# EAGLE design Base components (EAGLE 6.5.0)
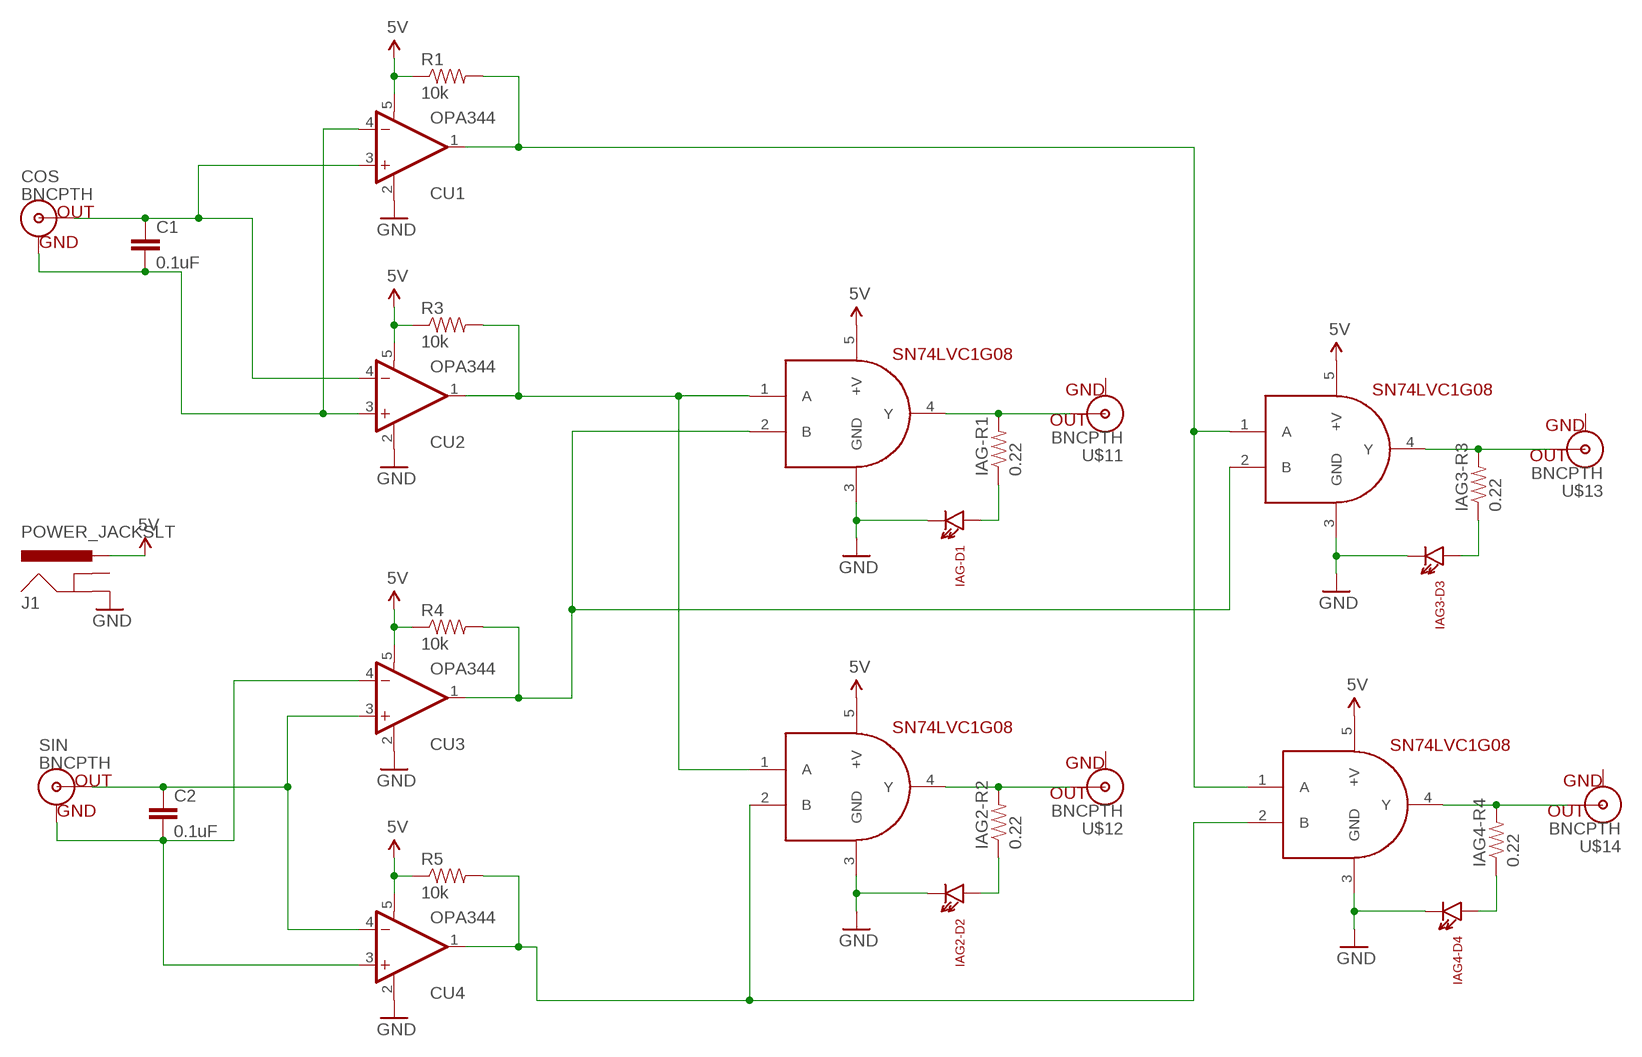
[diagram p0: schematic, sheet 1]

## Parts
C1  0.1uF  0.1UF-25V-5%(0603)  [0603-CAP]
C2  0.1uF  0.1UF-25V-5%(0603)  [0603-CAP]
COS  BNCPTH  [BNC]
CU1  OPA344  [SOT23-5]
CU2  OPA344  [SOT23-5]
CU3  OPA344  [SOT23-5]
CU4  OPA344  [SOT23-5]
IAG1  SN74LVC1G08  [SOT23-5]
IAG2  SN74LVC1G08  [SOT23-5]
IAG2-D2  LTE-302  [LTE-302]
IAG2-R2  0.22  0.22OHM1/4W1%(0805)  [0805]
IAG3  SN74LVC1G08  [SOT23-5]
IAG3-D3  LTE-302  [LTE-302]
IAG3-R3  0.22  0.22OHM1/4W1%(0805)  [0805]
IAG4  SN74LVC1G08  [SOT23-5]
IAG4-D4  LTE-302  [LTE-302]
IAG4-R4  0.22  0.22OHM1/4W1%(0805)  [0805]
IAG-D1  LTE-302  [LTE-302]
IAG-R1  0.22  0.22OHM1/4W1%(0805)  [0805]
J1  POWER_JACKSLT  [POWER_JACK_SLOT]
R1  10k  10KOHM-1/4W-1%(PTH)HORIZ  [AXIAL-0.3]
R3  10k  10KOHM-1/4W-1%(PTH)HORIZ  [AXIAL-0.3]
R4  10k  10KOHM-1/4W-1%(PTH)HORIZ  [AXIAL-0.3]
R5  10k  10KOHM-1/4W-1%(PTH)HORIZ  [AXIAL-0.3]
SIN  BNCPTH  [BNC]
U$11  BNCPTH  [BNC]
U$12  BNCPTH  [BNC]
U$13  BNCPTH  [BNC]
U$14  BNCPTH  [BNC]

## Nets
5V: CU1.5(V+) CU2.5(V+) CU3.5(V+) CU4.5(V+) IAG1.5(+V) IAG2.5(+V) IAG3.5(+V) IAG4.5(+V) J1.PWR R1.P$1 R3.P$1 R4.P$1 R5.P$1
GND: CU1.2(V-) CU2.2(V-) CU3.2(V-) CU4.2(V-) IAG1.3(GND) IAG2-D2.C IAG2.3(GND) IAG3-D3.C IAG3.3(GND) IAG4-D4.C IAG4.3(GND) IAG-D1.C J1.GND@2(GND)
N$1: CU1.1(OUT) IAG3.1(A) IAG4.1(A) R1.P$2
N$2: IAG4-R4.2 IAG4.4(Y) U$14.S(OUT)
N$3: IAG4-D4.A IAG4-R4.1
N$4: CU2.1(OUT) IAG1.1(A) IAG2.1(A) R3.P$2
N$5: CU3.1(OUT) IAG1.2(B) IAG3.2(B) R4.P$2
N$6: CU4.1(OUT) IAG2.2(B) IAG4.2(B) R5.P$2
N$7: C1.2 COS.GND CU1.4(-IN) CU2.3(+IN)
N$8: C1.1 COS.S(OUT) CU1.3(+IN) CU2.4(-IN)
N$9: C2.1 CU3.3(+IN) CU4.4(-IN) SIN.S(OUT)
N$11: C2.2 CU3.4(-IN) CU4.3(+IN) SIN.GND
N$12: IAG3-R3.2 IAG3.4(Y) U$13.S(OUT)
N$13: IAG3-D3.A IAG3-R3.1
N$14: IAG2-R2.2 IAG2.4(Y) U$12.S(OUT)
N$15: IAG2-D2.A IAG2-R2.1
N$16: IAG1.4(Y) IAG-R1.2 U$11.S(OUT)
N$17: IAG-D1.A IAG-R1.1
Unconnected: J1.GND@1(GNDBREAK) U$11.GND U$12.GND U$13.GND U$14.GND

## Library data of the parts
C1 C2 = SparkFun-Capacitors:0.1UF-25V-5%(0603): CAP-08604; PROD_ID: CAP-08604
COS SIN U$11-U$14 = SparkFun-Connectors:BNC: BNC Connector, Mouser Part# 5227161
CU1-CU4 = SparkFun-AnalogIC:OPA344: Single gate rail-to-rail output op-amp. Inputs extend 300mV past rails.
IAG1-IAG4 = SparkFun-DigitalIC:SN74LVC1G08: Single-gate AND logic
IAG2-D2 IAG3-D3 IAG4-D4 IAG-D1 = SparkFun-LED:LTE-302: Through-hole side-firing 940nm IR LED
IAG2-R2 IAG3-R3 IAG4-R4 IAG-R1 = SparkFun-Resistors:0.22OHM1/4W1%(0805): RES-09883; PROD_ID: RES-09883
J1 = SparkFun-Connectors:POWER_JACK: Power Jack This is the standard 5.5mm barrel jack for power. The PTH is the most common, proven, reliable, footprint. The Slot footprint only works if the mill layer is transmitted to the PCB fab house so be warned. Mating wall wart : TOL-00298 (and others); PROD_ID: PRT-00119
R1 R3-R5 = SparkFun-Resistors:10KOHM-1/4W-1%(PTH): RES-12183; PROD_ID: RES-12183

## Board
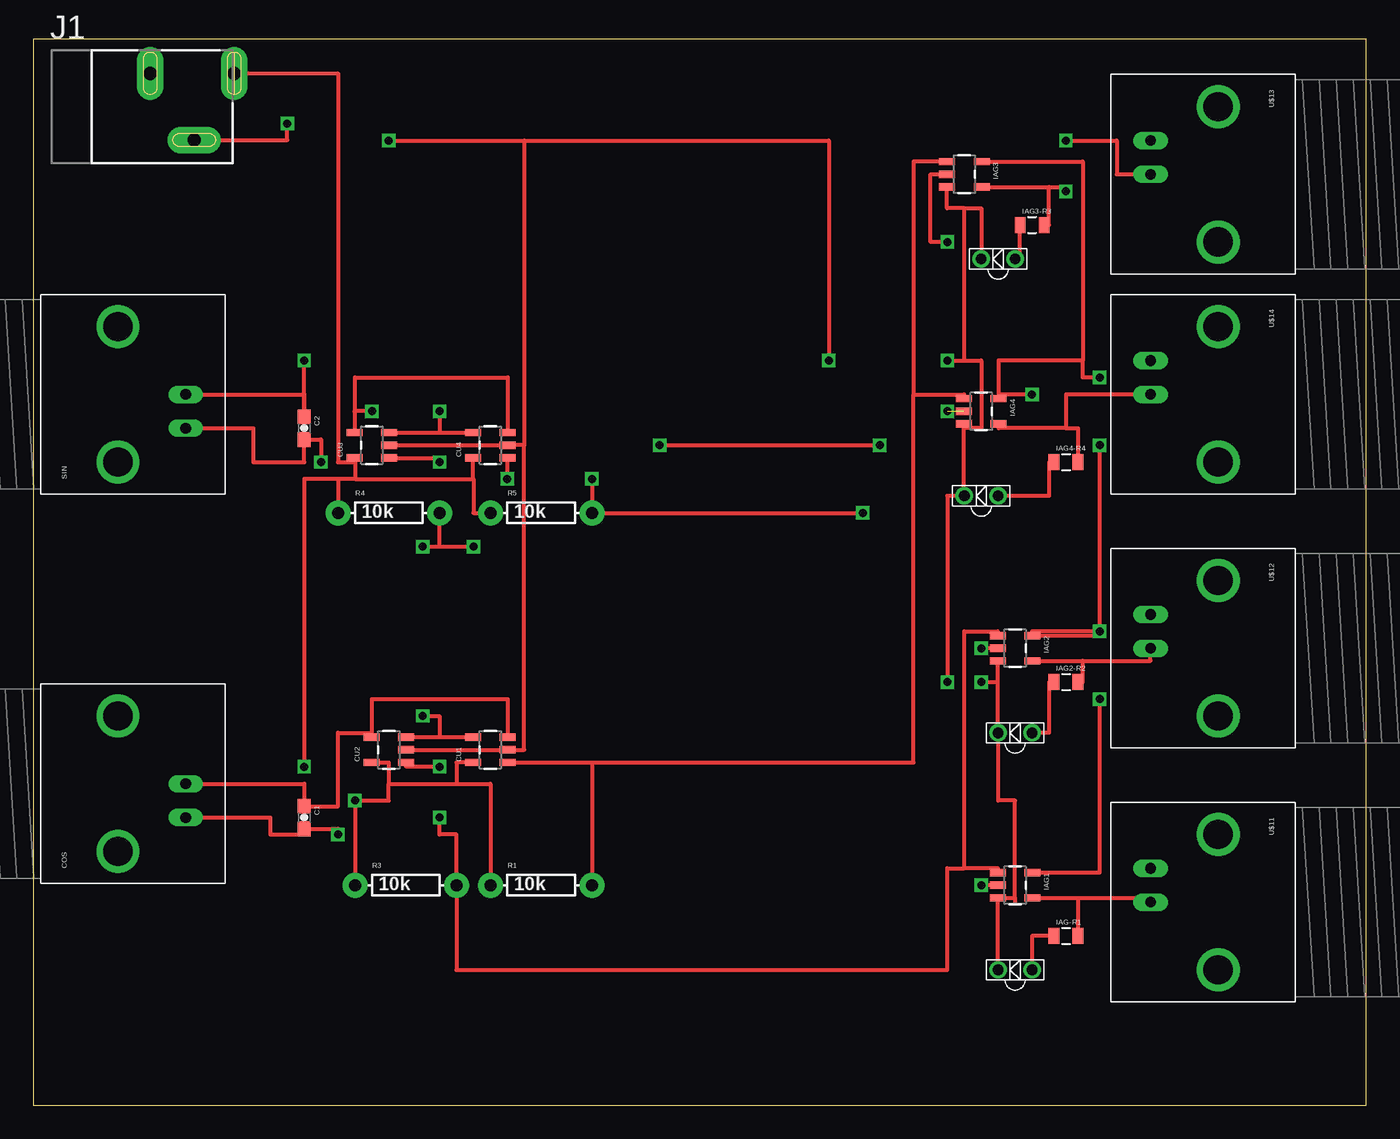
[diagram p1: board, top side]
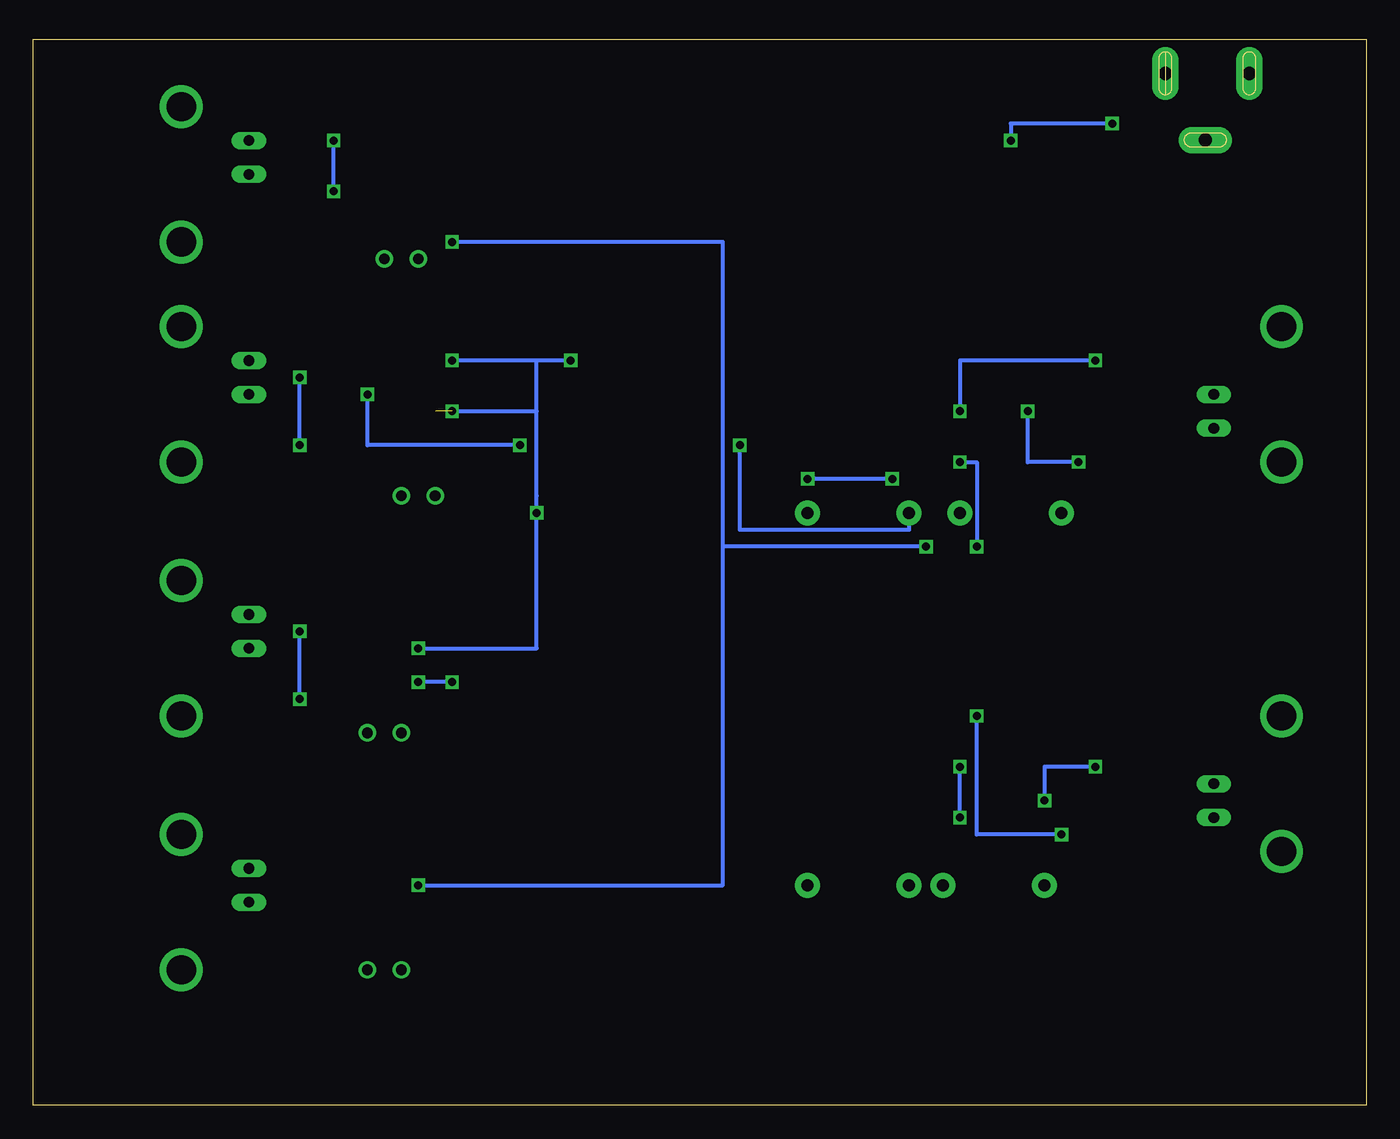
[diagram p2: board, bottom side, seen from below]

Size 100 x 80 mm. Coordinates in mm from the lower left corner, seen from the top.
Outline: 0,0 100,0 100,80 0,80 0,0
Copper layers (1*16): Top 0.035mm / dielectric 1.5mm / Bottom 0.035mm
Design rules "default": minimum track width 10mil, minimum drill 24mil, track to track 8mil, track to pad 8mil, pad to pad 8mil, via to via 8mil, smd to smd 8mil, copper to edge 40mil, drill to drill 8mil, minimum pad ring 10mil, minimum via ring 8mil, stop-mask expansion 4mil, vias tented up to drill 0mil, thermal gap 10mil

### Footprints (pad centres in the part's own frame; a part is rotated, then mirrored left to right if it is on the bottom)
0603-CAP = smd 1.1 x 1: 1 -0.85,0; 2 0.85,0
BNC = drill 2.2: 3 -5.08,5.08; 4 5.08,5.08 | drill 0.8 long: GND -2.54,0; S 0,0
SOT23-5 = smd 0.55 x 1.2: 1 -0.95,-1.3; 2 0,-1.3; 3 0.95,-1.3; 4 0.95,1.3; 5 -0.95,1.3
LTE-302 = drill 0.8: A 1.27,0; C -1.27,0
0805 = smd 0.8 x 1.2: 1 -0.9,0; 2 0.9,0
POWER_JACK_SLOT = drill 1 pad 2 long: GND@1 2.58,7.5; GND@2 7.58,10.8; PWR 2.58,13.8
AXIAL-0.3 = drill 0.9 pad 1.88: P$1 -3.81,0; P$2 3.81,0

### Placement (x,y rotation side)
C1  20.32,21.59 270 top
C2  20.32,50.8 270 top
COS  11.43,24.13 90 top
CU1  34.29,26.67 90 top
CU2  26.67,26.67 90 top
CU3  25.4,49.53 90 top
CU4  34.29,49.53 90 top
IAG1  73.66,16.51 270 top
IAG2  73.66,34.29 270 top
IAG2-D2  73.66,27.94 0 top
IAG2-R2  77.47,31.75 0 top
IAG3  69.85,69.85 270 top
IAG3-D3  72.39,63.5 0 top
IAG3-R3  74.93,66.04 0 top
IAG4  71.12,52.07 270 top
IAG4-D4  71.12,45.72 0 top
IAG4-R4  77.47,48.26 0 top
IAG-D1  73.66,10.16 0 top
IAG-R1  77.47,12.7 0 top
J1  1.27,80.01 270 top
R1  38.1,16.51 0 top
R3  27.94,16.51 0 top
R4  26.67,44.45 0 top
R5  38.1,44.45 0 top
SIN  11.43,53.34 90 top
U$11  83.82,15.24 270 top
U$12  83.82,34.29 270 top
U$13  83.82,69.85 270 top
U$14  83.82,53.34 270 top

### Tracks (layer width: path | path; a pad name or v marks a point on that pad's centre or on a via)
5V  (via drill 0.6)
  Top 0.305: CU1.5 31.75,25.72 31.75,24.13 | 24.13,46.99 24.13,48.58 CU3.5 24.1,48.26 22.86,48.26 22.86,77.43 J1.PWR | 24.13,46.99 32.99,46.99 | 32.99,46.99 CU4.5 | CU2.5 26.67,25.72 26.67,24.13 | 26.67,24.13 31.75,24.13 | 22.86,46.99 20.32,46.99 v20.32,25.4 | 26.67,24.13 26.67,22.86 v24.13,22.86 R3.P$1 | 31.75,24.13 34.29,24.13 R1.P$1 | 24.13,46.99 22.86,46.99 | 22.86,46.99 R4.P$1 | 32.99,46.99 33.02,46.99 33.02,44.45 R5.P$1 | IAG3.5 78.74,70.8 78.74,55.88 | 78.74,55.88 72.42,55.88 IAG4.5 72.42,53.34 v74.93,53.34 | IAG1.5 80.01,17.46 v80.01,30.48 | v80.01,35.56 74.96,35.56 | 74.93,35.56 74.96,35.56 | 74.96,35.56 IAG2.5 80.01,35.24 v80.01,49.53 | v80.01,54.61 78.74,54.61 78.74,55.88 | v46.99,49.53 v63.5,49.53
  Bottom 0.305: v20.32,25.4 24.13,25.4 v24.13,22.86 | v80.01,30.48 v80.01,35.56 | v80.01,49.53 v80.01,54.61 | R5.P$1 34.29,43.18 46.99,43.18 v46.99,49.53 | v63.5,49.53 74.93,49.53 v74.93,53.34
GND  (via drill 0.6)
  Top 0.305: CU2.2 CU1.2 36.83,26.67 36.83,49.53 | 36.83,49.53 CU4.2 CU3.2 | 69.85,67.31 68.55,67.31 IAG3.3 | J1.GND@2 19.05,72.43 v19.05,73.66 | v26.67,72.39 36.83,72.39 | 36.83,72.39 36.83,49.53 | 36.83,72.39 59.69,72.39 v59.69,55.88 | v68.58,55.88 69.85,55.88 | 69.85,55.88 69.85,67.31 | v68.58,31.75 68.58,45.72 IAG4-D4.C 69.82,45.72 IAG4.3 69.82,50.8 71.12,50.8 71.12,55.88 69.85,55.88 | v71.12,31.75 72.36,31.75 | 72.36,31.75 IAG2.3 | IAG-D1.C 72.36,10.16 IAG1.3 73.66,15.56 | 73.66,15.56 73.66,15.24 | 73.66,15.56 73.66,22.86 72.39,22.86 IAG2-D2.C 72.36,27.94 72.36,31.75 | 69.85,67.31 71.12,67.31 IAG3-D3.C
  Bottom 0.305: v19.05,73.66 26.67,73.66 v26.67,72.39 | v59.69,55.88 v68.58,55.88 | v68.58,31.75 v71.12,31.75
N$1
  Top 0.305: CU1.1 41.91,25.72 | 41.91,25.72 R1.P$2 | 41.91,25.72 66.04,25.72 66.04,53.34 | 66.04,53.34 69.82,53.34 IAG4.1 | IAG3.1 66.04,70.8 66.04,53.34
N$2
  Top 0.305: U$14.S 77.47,53.34 77.47,50.8 | 77.47,50.8 72.42,50.8 IAG4.4 | 77.47,50.8 78.37,50.8 IAG4-R4.2
N$3
  Top 0.305: IAG4-R4.1 76.2,48.26 76.2,45.72 IAG4-D4.A
N$4  (via drill 0.6)
  Top 0.305: v30.48,21.59 30.48,20.32 31.75,20.32 R3.P$2 31.75,10.16 68.58,10.16 68.58,17.78 69.85,17.78 | v30.48,25.4 27.97,25.4 CU2.1 | IAG1.1 72.36,17.78 69.85,17.78 | 69.85,17.78 69.85,35.56 72.36,35.56 IAG2.1
  Bottom 0.305: v30.48,21.59 v30.48,25.4
N$5  (via drill 0.6)
  Top 0.305: CU3.1 30.48,48.58 v30.48,48.26 | v29.21,41.91 30.48,41.91 | 30.48,41.91 R4.P$2 | 30.48,41.91 v33.02,41.91 | v68.58,64.77 67.31,64.77 67.31,69.85 IAG3.2 | IAG1.2 v71.12,16.51
  Bottom 0.305: v30.48,48.26 29.21,48.26 v29.21,41.91 | v33.02,41.91 48.26,41.91 | 48.26,41.91 48.26,64.77 v68.58,64.77 | v71.12,16.51 48.26,16.51 48.26,41.91
N$6  (via drill 0.6)  (1 unrouted)
  Top 0.305: IAG2.2 v71.12,34.29 | CU4.1 35.56,48.58 v35.56,46.99 | v41.91,46.99 R5.P$2 v62.23,44.45
  Bottom 0.305: v68.58,52.07 62.23,52.07 | 62.23,52.07 62.23,55.88 | v71.12,34.29 62.23,34.29 v62.23,44.45 62.23,45.72 62.23,52.07 | v35.56,46.99 v41.91,46.99
N$7  (via drill 0.6)
  Top 0.305: CU2.3 30.48,27.62 | 30.48,27.62 CU1.4 | COS.GND 17.78,21.59 17.78,20.32 20.32,20.32 C1.2 22.86,20.74 v22.86,20.32 | v29.21,29.21 30.48,29.21 30.48,27.62
  Bottom 0.305: v22.86,20.32 29.21,20.32 v29.21,29.21
N$8
  Top 0.305: COS.S 20.32,24.13 C1.1 22.86,22.44 22.86,27.94 25.37,27.94 CU2.4 25.4,27.62 25.4,30.48 35.59,30.48 CU1.3
N$9  (via drill 0.6)
  Top 0.305: CU3.3 30.48,50.48 | 30.48,50.48 CU4.4 | SIN.S 20.32,53.34 C2.1 v20.32,55.88 | v30.48,52.07 30.48,50.48
  Bottom 0.305: v20.32,55.88 30.48,55.88 v30.48,52.07
N$11  (via drill 0.6)
  Top 0.305: CU4.3 35.59,54.61 24.13,54.61 24.13,50.48 CU3.4 24.1,52.07 v25.4,52.07 | SIN.GND 16.51,50.8 16.51,48.26 20.32,48.26 C2.2 21.59,49.95 v21.59,48.26
  Bottom 0.305: v21.59,48.26 25.4,48.26 v25.4,52.07
N$12  (via drill 0.6)
  Top 0.305: IAG3.4 76.2,68.9 | 76.2,68.9 77.47,68.9 v77.47,68.58 | v77.47,72.39 81.28,72.39 81.28,69.85 U$13.S | IAG3-R3.2 76.2,66.04 76.2,68.9
  Bottom 0.305: v77.47,68.58 v77.47,72.39
N$13
  Top 0.305: IAG3-D3.A 74.03,63.5 IAG3-R3.1
N$14
  Top 0.305: IAG2.4 78.74,33.34 | 78.74,33.34 83.82,33.34 U$12.S | IAG2-R2.2 78.74,31.75 78.74,33.34
N$15
  Top 0.305: IAG2-R2.1 76.2,31.75 76.2,27.94 IAG2-D2.A
N$16
  Top 0.305: U$11.S 83.82,15.56 IAG1.4 78.37,15.56 IAG-R1.2
N$17
  Top 0.305: IAG-R1.1 74.93,12.7 IAG-D1.A